# Altium schematic sheet Flyback.SchDoc
size A; SheetNumber: 13; SheetTotal: 16
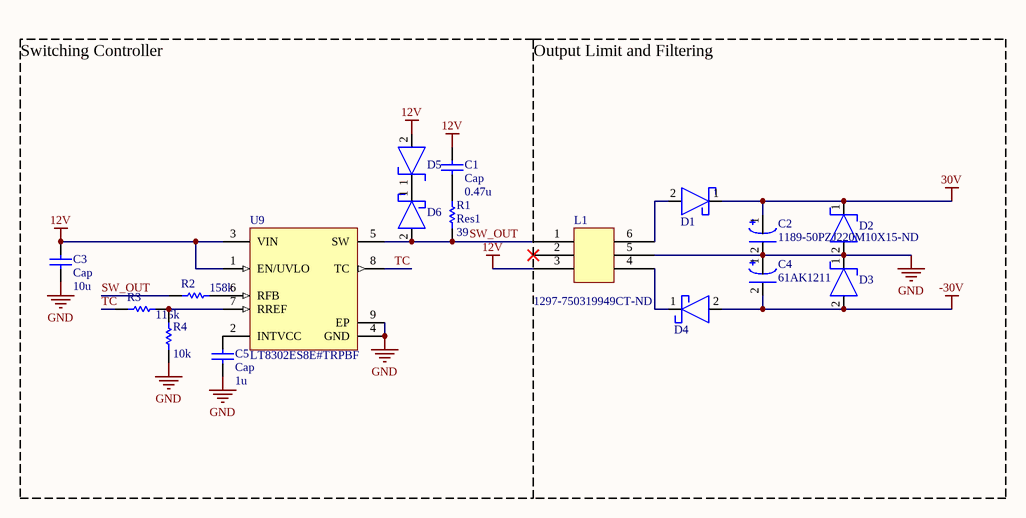
[diagram p0: Flyback.SchDoc]

## Parts
C1  Cap  value 0.47u  [CAPC1608X05N]
C2  Supplier Part Number 1: 1189-50PZJ220M10X15-ND  [A759KR227M1VAAE024]  (hidden comment: 220uF Cap)
C3  Cap  value 10u  [CAPC1608X05N]
C4  Supplier Part Number 1: 61AK1211  [A759KR227M1VAAE024]  (hidden comment: 220uF Cap)
C5  Cap  value 1u  [CAPC1608X05N]
D1  Schottky 60V  [SK36A-LTP - duplicate]  (value not drawn)
D2  Zener 30V  [SMBJ5363B-TP]  (value not drawn)
D3  Zener 30V  [SMBJ5363B-TP]  (value not drawn)
D4  Schottky 60V  [SK36A-LTP - duplicate]  (value not drawn)
D5  Zener 24V  [CMZ5934B TR13 PBFREE]  (value not drawn)
D6  Schottky 60V  [SK36A-LTP - duplicate]  (value not drawn)
L1  Supplier Part Number 1: 1297-750319949CT-ND  [750319949]  (hidden comment: Flyback Transformer)
R1  Res1  value 39  [0402_Res]
R2  value 158k  [0402_Res]  (hidden comment: Res1)
R3  value 115k  [0402_Res]  (hidden comment: Res1)
R4  value 10k  [0402_Res]  (hidden comment: Res1)
U9  LT8302ES8E#TRPBF  [LT-S8E-8_V]

## Nets
12V: C1.2 C3.2 D5.2 L1.3 U9.1(EN/UVLO) U9.3(VIN)
30V: C2.1(Vin) D1.1 D2.1
-30V: C4.2(Vin) D3.2 D4.2
GND: C2.2(Vin) C3.1 C4.1(Vin) C5.1 D2.2 D3.1 L1.5 R4.1 U9.4(GND) U9.9(EP)
SW_OUT: D6.2 L1.1 R1.1 R2.1 U9.5(SW)
TC: R3.1 U9.8(TC)
NetC1_1: C1.1 R1.2
NetC5_2: C5.2 U9.2(INTVCC)
NetD1_2: D1.2 L1.6
NetD4_1: D4.1 L1.4
NetD5_1: D5.1 D6.1
NetR2_2: R2.2 U9.6(RFB)
NetR3_2: R3.2 R4.2 U9.7(RREF)

Not connected (* = marked no-connect by the designer): L1 2*

## Notes on the sheet
- Switching Controller
- Output Limit and Filtering

## Library data of the parts
C1 C3 C5 = Cap: Capacitor; Published: 8-Jun-2000; LatestRevisionDate: 17-Jul-2002; LatestRevisionNote: Re-released for DXP Platform.; PackageReference: RAD-0.3; Publisher: Altium Limited; PackageDescription: Radial Cap, Thru-Hole; 2 Leads; 0.3 in Pin Spacing
C2 C4 = A759KR227M1VAAE024
  C2: Supplier 1: DigiKey
  C4: Supplier 1: Newark
D1 D4 D6 = SK36A-LTP: Supplier 1: Arrow Electronics
D2 D3 = SMBJ5363B-TP: Supplier 1: Arrow Electronics
D5 = CMZ5934B TR13 PBFREE: Supplier 1: DigiKey; Supplier Part Number 1: 1514-CMZ5934BTR13PBFREECT-ND
L1 = 750319949: Supplier 1: DigiKey
R1-R4 = Res1: Resistor; Published: 8-Jun-2000; LatestRevisionDate: 17-Jul-2002; LatestRevisionNote: Re-released for DXP Platform.; PackageReference: AXIAL-0.3; Publisher: Altium Limited; PackageDescription: Axial Device, Thru-Hole; 2 Leads; 0.3 in Pin Spacing
U9 = CMP-0492-02712-1: Micropower No-Opto Isolated Flyback Converter, 2.8 to 42 V, -40 to 125 degC, 8-Pin SOIC (S8E), RoHS, Tape and Reel; PartNumber: LT8302; Number of Outputs: 1; Output Current: 3.6 A; VIN Min: 2.8 V; VIN Max: 42 V; Packing: Tape and Reel; ComponentLink3Description: Package Specification; ComponentLink1URL: http://www.linear.com/; ComponentLink1Description: Manufacturer URL; ComponentLink2URL: http://cds.linear.com/docs/en/datasheet/8302fa.pdf; RoHS: TRUE; Mounting Technology: Surface Mount; ComponentLink3URL: http://cds.linear.com/docs/en/packaging/05081857_A_S8E.pdf; Temperature Min: -40 degC; DatasheetVersion: Rev. A; Temperature Max: 125 degC; PackageVersion: Rev. A, 10/2013; PackageDescription: 8-Pin Plastic Small Outline Integrated Circuit Package, Body 4.90 x 3.90 mm, Pitch 1.27 mm; ComponentLink2Description: Datasheet